# EAGLE design amc7135-testboard-mk-1.2 (EAGLE 7.5.0)
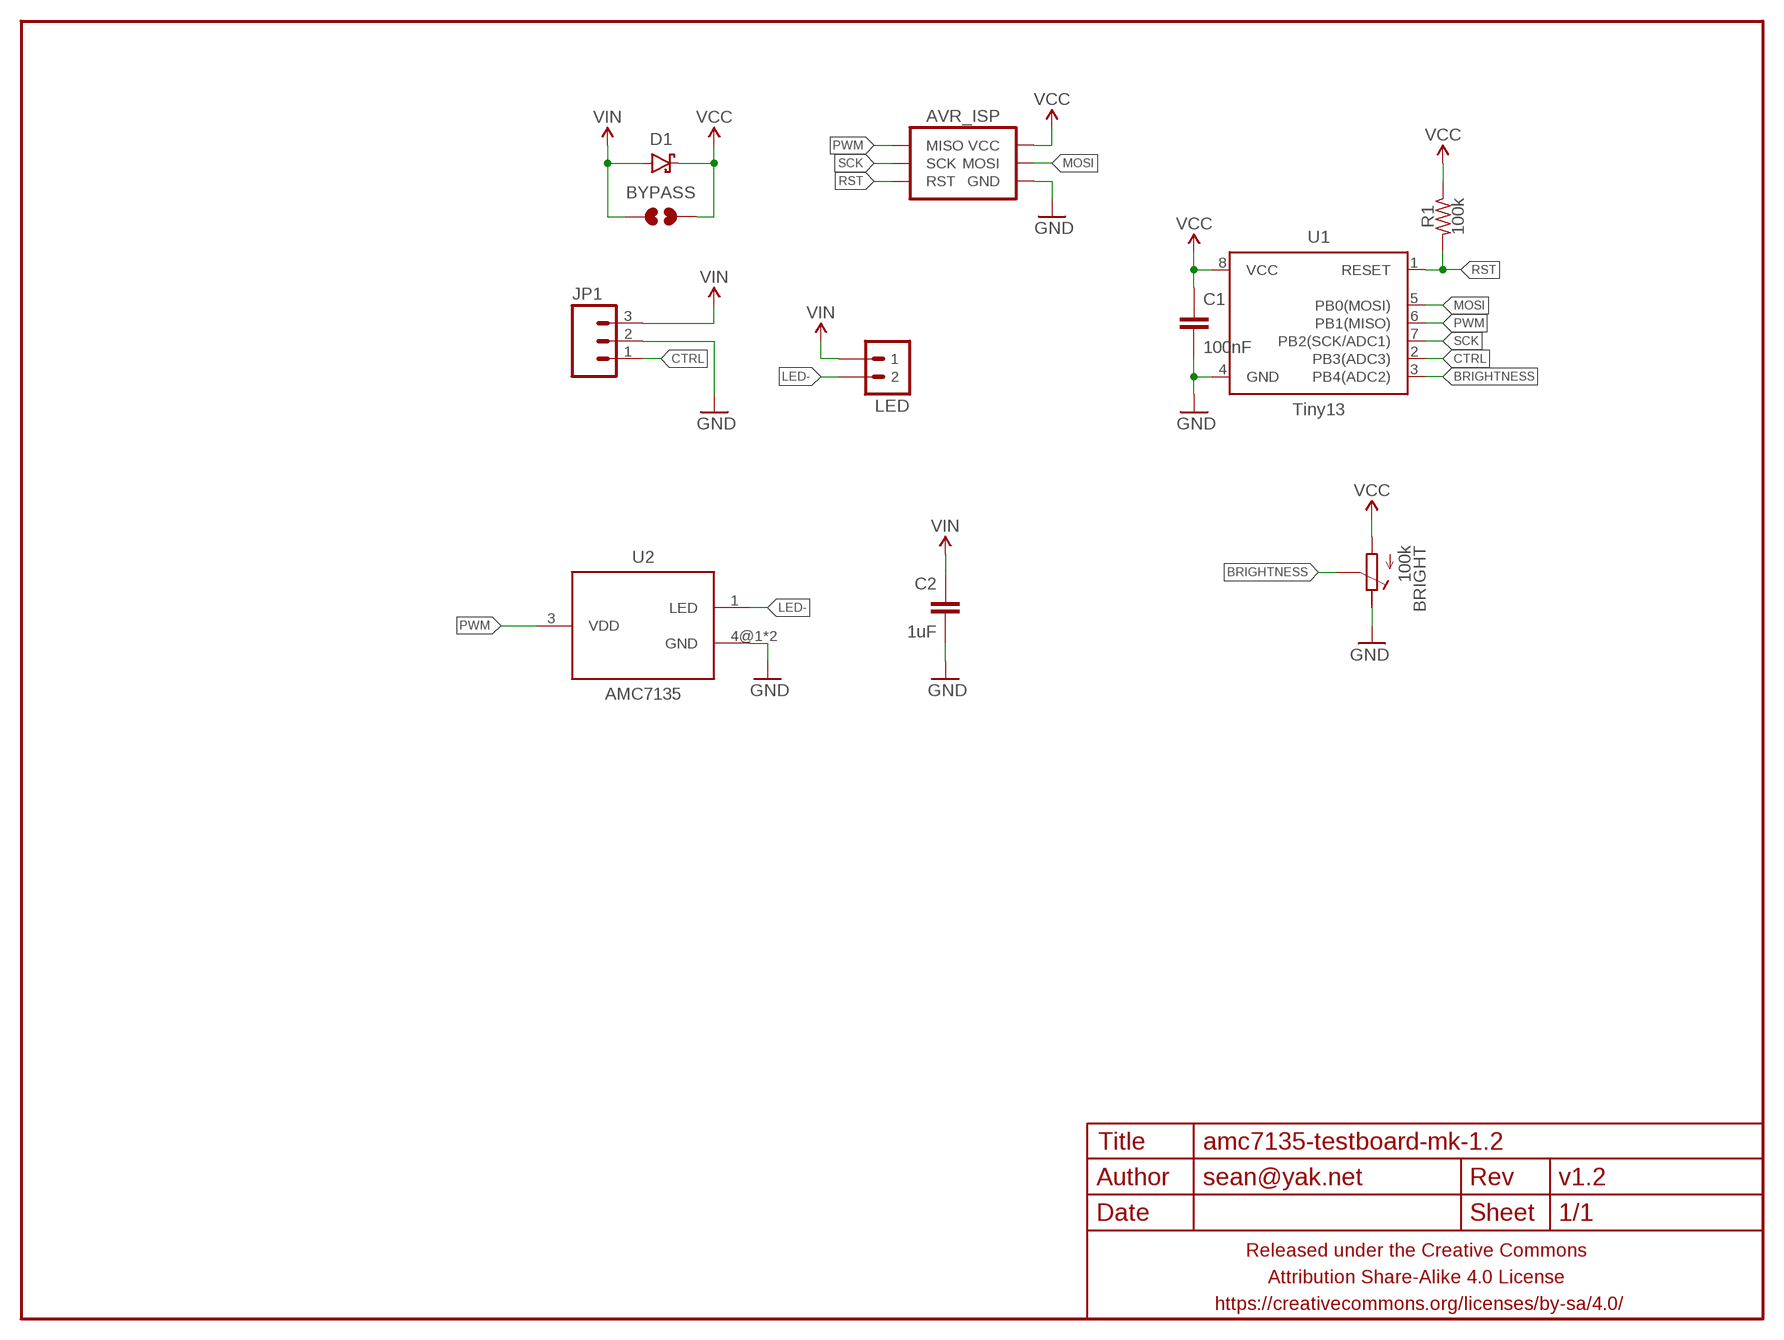
[diagram p0: schematic, sheet 1]

## Parts
AVR_ISP  AVR_SPI_PRG_6SMD_TEST_POINTS  [2X3_SMD_TEST_POINTS]
BRIGHT  100k  POTENTIOMETEREVM3Y  [EVM3Y]
BYPASS  JUMPER-PAD-2-NOYES_SILK  [PAD-JUMPER-2-NO_YES_SILK]
C1  100nF  CAPACITOR-CERAMICC0603-TIGHTER  [C0603-TIGHTER]
C2  1uF  CAPACITOR-CERAMICC0603-TIGHTER  [C0603-TIGHTER]
D1  DIODE-SCHOTTKYSOD323  [SOD323-SCHOTTKY]
FRAME1  FRAME-LETTERNO_PACKAGE  [DUMMY]
JP1  M03PTH-CENTERED  [1X03-CENTERED]
LED  M02PTH-CENTERED  [1X02-CENTER]
R1  100k  RESISTORR0603-TIGHTER  [R0603-TIGHTER]
U1  Tiny13  ATTINY13SOIC  [SO08]
U2  AMC7135  AMC7135SOT-89-NOTHERM  [SOT89-NOTHERM]

## Nets
BRIGHTNESS: BRIGHT.S U1.3(PB4(ADC2))
CTRL: JP1.1 U1.2(PB3(ADC3))
GND: AVR_ISP.6(GND) BRIGHT.E C1.2 C2.2 JP1.2 U1.4(GND) U2.4@1(GND) U2.4@2(GND)
LED-: LED.2 U2.1(LED)
MOSI: AVR_ISP.4(MOSI) U1.5(PB0(MOSI))
PWM: AVR_ISP.1(MISO) U1.6(PB1(MISO)) U2.3(VDD)
RST: AVR_ISP.5(RST) R1.2 U1.1(RESET)
SCK: AVR_ISP.3(SCK) U1.7(PB2(SCK/ADC1))
VCC: AVR_ISP.2(VCC) BRIGHT.A BYPASS.2 C1.1 D1.C R1.1 U1.8(VCC)
VIN: BYPASS.1 C2.1 D1.A JP1.3 LED.1

## Library data of the parts
AVR_ISP = a_parts:AVR_SPI_PRG_6: AVR ISP 6 Pin This is the reduced ISP connector for AVR programming. Common on Arduino. This footprint will take up less PCB space and can be used with a 10-pin to 6-pin adapter such as SKU: BOB-08508 **Special note about "TEST_POINT" package. The stop mask is on the top side, so if you want your programming test points to be on the bottom of your board, make sure to place this package on the bottom side of the board. This also ensure that the orientation to program from the bottom side will be correct.
BRIGHT = A_butts:POTENTIOMETER: Trimm resistor
BYPASS = a_parts:JUMPER-PAD-2-NO
C1 C2 = a_parts:CAPACITOR-CERAMIC: CAPACITOR, European symbol
D1 = a_parts:DIODE-SCHOTTKY: Schottky diodes in SFE's production catalog BAT20J 1A 23V 0.62Vf RB751 120mA 40V 0.37Vf PMEG4005EJ 0.5A 40V 0.42Vf MBRA140 1A 40V 0.5Vf B340A 3A 40V SMA
FRAME1 = a_parts:FRAME-LETTER: Schematic Frame Standard 8.5x11 US Letter frame; DESIGNER: sean@yak.net; VERSION: v1.2
JP1 = a_parts:M03: Header 3 Standard 3-pin 0.1" header. Use with straight break away headers (SKU : PRT-00116), right angle break away headers (PRT-00553), swiss pins (PRT-00743), machine pins (PRT-00117), and female headers (PRT-00115). Molex polarized connector foot print use with SKU : PRT-08232 with associated crimp pins and housings.
LED = a_parts:M02: Standard 2-pin 0.1" header. Use with - straight break away headers ( PRT-00116) - right angle break away headers (PRT-00553) - swiss pins (PRT-00743) - machine pins (PRT-00117) - female headers (PRT-00115) Molex polarized connector foot print use with: PRT-08233 with associated crimp pins and housings. 2.54_SCREWTERM for use with PRT-10571. 3.5mm Screw Terminal footprints for PRT-08084 5mm Screw Terminal footprints for use with PRT-08433
R1 = a_parts:RESISTOR: RESISTOR, American symbol
U1 = a_parts:ATTINY13: Atmel 8-pin 1kB flash uC
U2 = a_parts:AMC7135

## Board
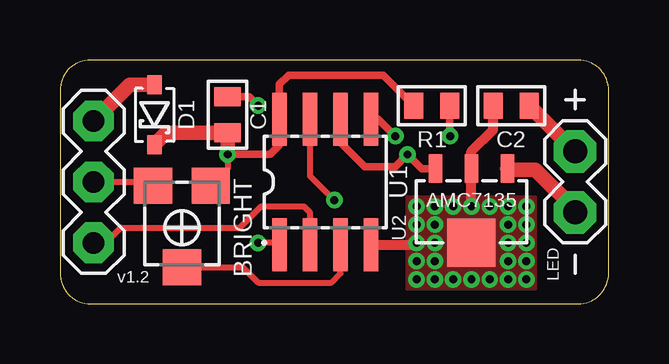
[diagram p1: board, top side]
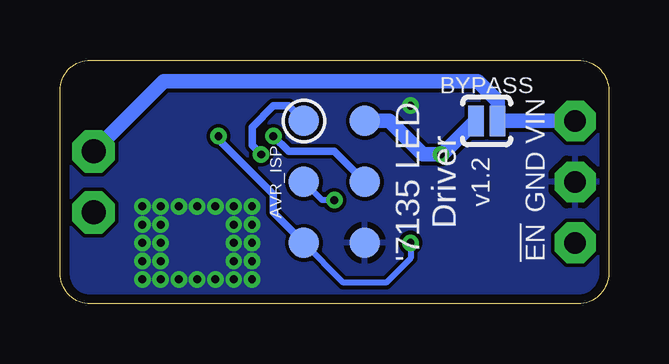
[diagram p2: board, bottom side, seen from below]

Size 22.86 x 10.16 mm. Coordinates in mm from the lower left corner, seen from the top.
Outline: 22.86,1.27 22.86,8.89 arc90 21.59,10.16 1.27,10.16 arc90 0,8.89 0,1.27 arc90 1.27,0 21.59,0 arc90 22.86,1.27
Copper layers (1*16): Top 0.0356mm / dielectric 1.5011mm / Bottom 0.0356mm
Design rules "LaenPCBOrder2": minimum track width 6mil, minimum drill 13mil, track to track 6mil, track to pad 6mil, pad to pad 6mil, via to via 6mil, smd to smd 6mil, copper to edge 15mil, drill to drill 6mil, minimum pad ring 7mil, minimum via ring 7mil, stop-mask expansion 3mil, vias tented up to drill 20mil, thermal gap 10mil

### Footprints (pad centres in the part's own frame; a part is rotated, then mirrored left to right if it is on the bottom)
2X3_SMD_TEST_POINTS = smd 1.27 x 1.27: 1 -2.54,-1.27; 2 -2.54,1.27; 3 0,-1.27; 4 0,1.27; 5 2.54,-1.27; 6 2.54,1.27
EVM3Y = smd 1.6 x 1.5: A -1.2,-1.75; E 1.2,-1.75; S 0,1.65
PAD-JUMPER-2-NO_YES_SILK = smd 0.635 x 1.27: 1 -0.45,0; 2 0.45,0
C0603-TIGHTER = smd 0.8 x 1.1: 1 -0.75,0; 2 0.75,0
SOD323-SCHOTTKY = smd 0.8 x 0.6: A -1.25,0; C 1.25,0
1X03-CENTERED = drill 0.9 pad 1.7 octagon: 1 -2.54,0; 2 0,0; 3 2.54,0
1X02-CENTER = drill 1 pad 1.778 octagon: 1 -1.27,0; 2 1.27,0
R0603-TIGHTER = smd 0.8 x 1.1: 1 -0.75,0; 2 0.75,0
SO08 = smd 0.61 x 2.21: 1 -1.905,-2.616; 2 -0.635,-2.616; 3 0.635,-2.616; 4 1.905,-2.616; 5 1.905,2.616; 6 0.635,2.616; 7 -0.635,2.616; 8 -1.905,2.616
SOT89-NOTHERM = smd 0.58 x 1.2: 1 -1.5,-1.8; 3 1.5,-1.8; 4@1 0,-1.8 | smd 2 x 2: 4@2 0,1.3

### Placement (x,y rotation side)
AVR_ISP  11.43,5.08 270 bottom
BRIGHT  5.08,3.17 180 top
BYPASS  5.08,7.62 180 bottom
C1  6.99,7.87 90 top
C2  18.8,8.26 180 top
D1  3.94,7.87 270 top
FRAME1  0,0 0 top
JP1  1.4,5.08 90 top
LED  21.46,5.08 270 top
R1  15.49,8.26 0 top
U1  11.05,5.08 0 top
U2  17.14,3.84 180 top

### Tracks (layer width: path | path; a pad name or v marks a point on that pad's centre or on a via)
BRIGHTNESS
  Top 0.254: BRIGHT.S 7.62,1.52 8.26,0.89 11.3,0.89 11.68,1.27 U1.3
CTRL
  Top 0.254: JP1.1 1.91,2.54 2.54,3.17 7.49,3.17 8.38,4.06 10.16,4.06 10.41,3.81 U1.2
GND  (via drill 0.33)
  Top 0.254: JP1.2 3.88,5.08 BRIGHT.E
  Top 0.305: v8.26,8.26 7.89,8.62 C1.2
  Top 0.406: U1.4 14.78,2.46 v14.86,2.54 | v17.14,4.06 U2.4@1 17.14,6.35 18.05,7.25 C2.2
  other vias: 15.62,1.02 15.62,1.78 15.62,2.54 15.62,3.3 18.67,1.02 18.67,1.78 18.67,2.54 18.67,3.3 17.91,1.02 17.14,1.02 16.38,1.02 15.62,4.06 16.38,4.06 17.91,4.06 18.67,4.06 14.86,1.02 14.86,1.78 14.86,3.3 14.86,4.06 19.43,1.02 19.43,1.78 19.43,2.54 19.43,3.3 19.43,4.06
  pour Bottom: 22.86,1.27 22.86,8.89 arc90 21.59,10.16 1.27,10.16 arc90 0,8.89 0,1.27 arc90 1.27,0 21.59,0 arc90
  pour Top: 19.81,0.64 14.48,0.64 14.48,4.45 19.81,4.45
LED-
  Top 0.61: LED.2 21.46,3.94 19.81,5.59 18.69,5.59 U2.1
MOSI  (via drill 0.33)
  Top 0.305: U1.5 13.26,7.7 v13.97,6.99
  Bottom 0.305: v13.97,6.99 13.34,6.35 11.43,6.35 AVR_ISP.4
PWM  (via drill 0.33)
  Top 0.305: U1.6 11.68,6.73 12.7,5.71 13.97,5.71 v14.48,6.22 15.07,5.63 U2.3
  Bottom 0.305: v14.48,6.22 14.86,6.6 14.86,7.37 13.97,8.26 13.34,8.26 AVR_ISP.1
RST  (via drill 0.33)
  Top 0.254: U1.1 9.07,2.54 v8.26,2.54
  Top 0.305: v16.26,6.99 16.24,7 R1.2
  Bottom 0.254: v8.26,2.54 8.26,1.91 9.27,0.89 11.05,0.89 AVR_ISP.5
  Bottom 0.305: AVR_ISP.5 13.97,3.81 13.97,4.57 16.26,6.86 v16.26,6.99
SCK  (via drill 0.33)
  Top 0.254: U1.7 10.41,5.33 v11.43,4.32
  Bottom 0.254: v11.43,4.32 11.94,4.32 AVR_ISP.3
VCC  (via drill 0.33)
  Top 0.254: BRIGHT.A 6.99,5.63 v6.99,6.22
  Top 0.305: v6.99,6.22 8.76,6.22 9.14,6.6 U1.8 9.14,9.14 9.53,9.53 13.47,9.53 R1.1
  Top 0.61: D1.C 4.44,7.12 C1.1 v6.99,6.22
  Bottom 0.61: BYPASS.2 6.93,6.22 v6.99,6.22 7.75,6.22 9.14,7.62 AVR_ISP.2
VIN
  Top 0.61: JP1.3 2.9,9.12 D1.A | C2.1 LED.1
  Bottom 0.61: JP1.3 BYPASS.1 4.63,8.44 5.46,9.27 18.54,9.27 LED.1

### Text on the board
bPlace: VIN | GND | !EN
bNames: '7135 LED / Driver